# EAGLE design ai_breakout_tinyspi (EAGLE 6.5.0)
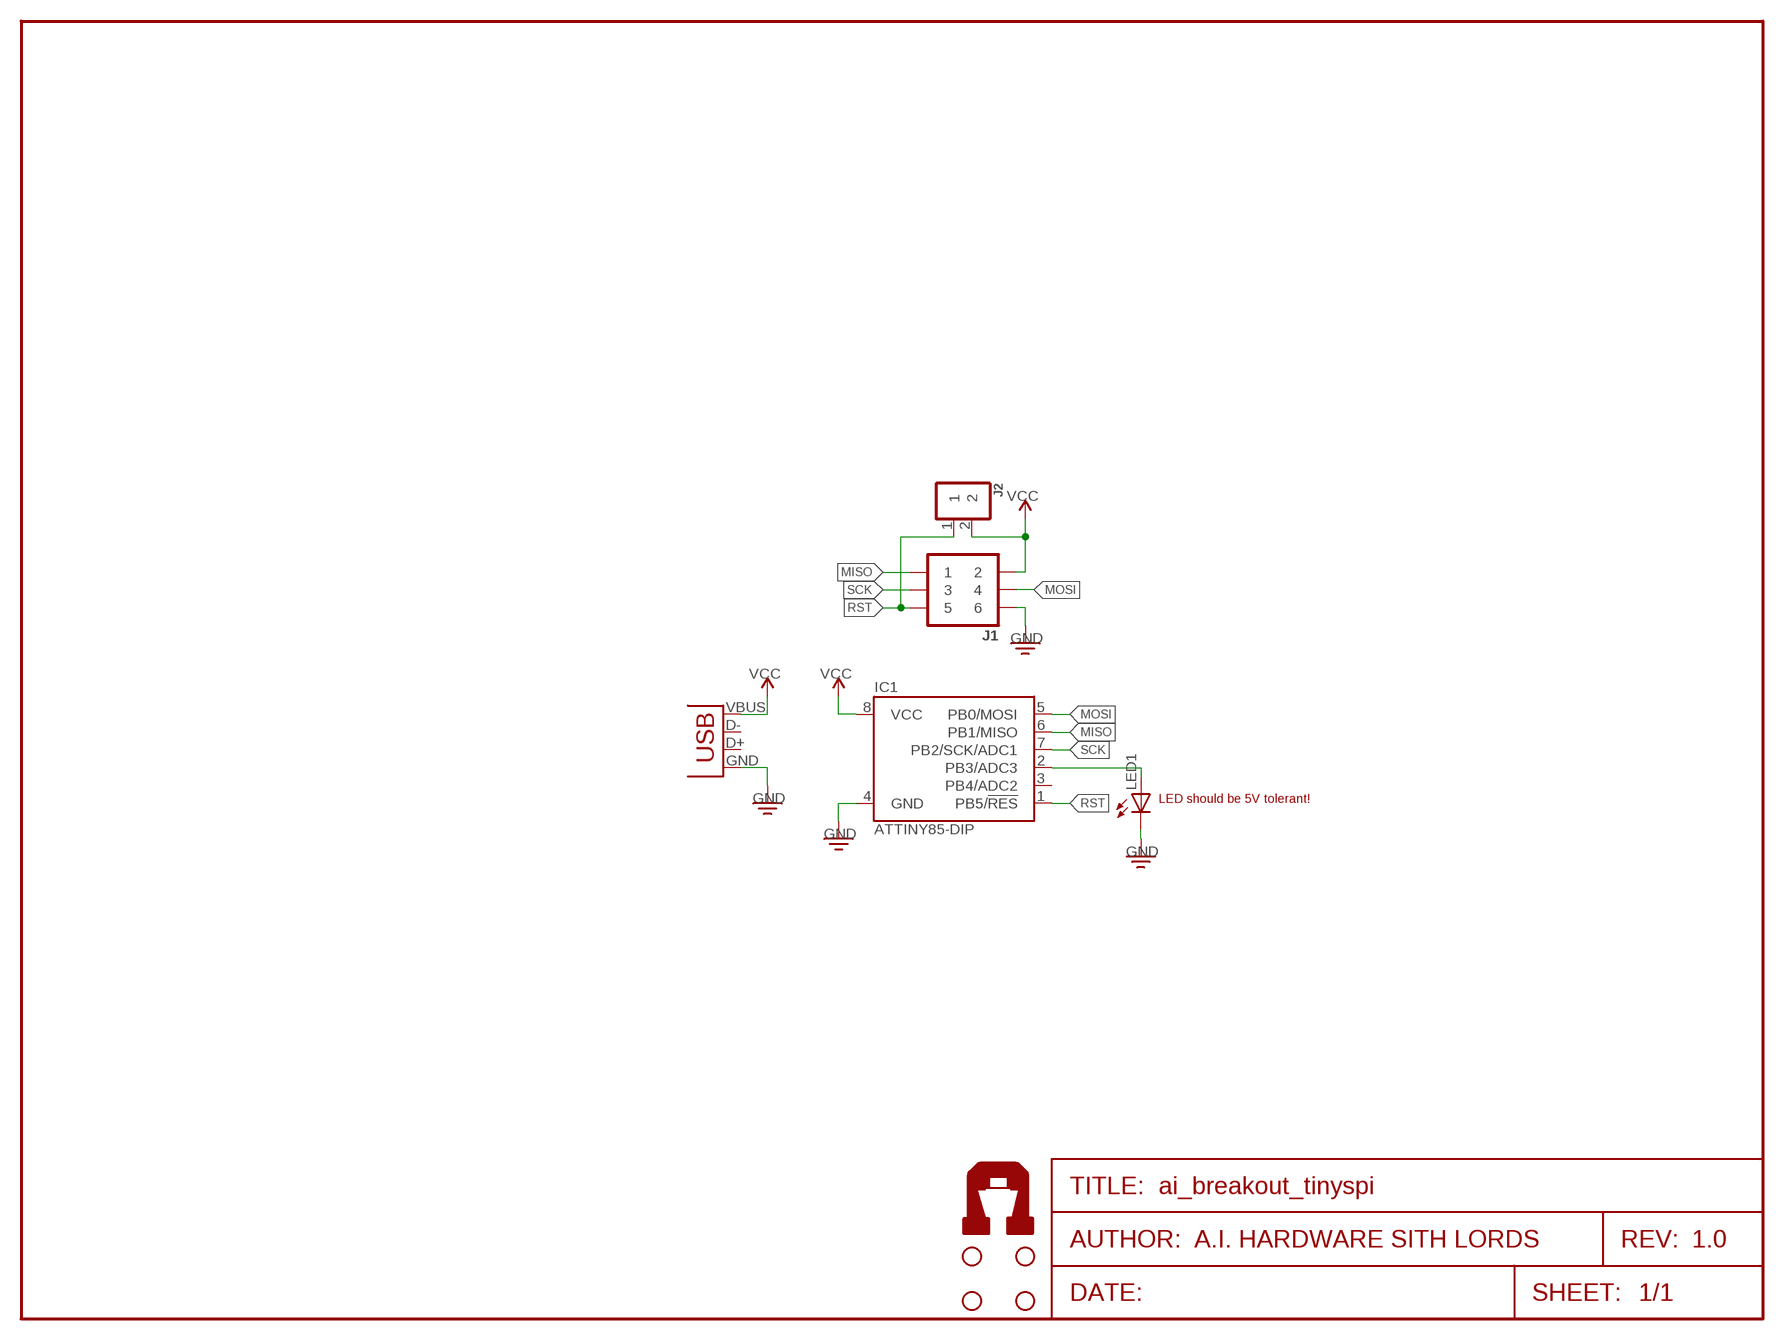
[diagram p0: schematic, sheet 1]
FRAME1 (FRAME-LETTER): AUTHOR: A.I. HARDWARE SITH LORDS; REV: 1.0

## Parts
IC1  ATTINY85-DIP  [DIL08]
J1  2X03  [2X03]
J2  1X02NOFIRST  [1X02-NOFIRST]
LED1  LED5MM  [LED-5MM]
STANDOFF1  STAND-OFF  [STAND-OFF]
STANDOFF2  STAND-OFF  [STAND-OFF]
STANDOFF3  STAND-OFF  [STAND-OFF]
STANDOFF4  STAND-OFF  [STAND-OFF]
U$1  AI-LOGOXS  [AI-LOGO-XS]
USB1  USBMICROB-TH  [USB-MICROB-TH]

## Nets
GND: IC1.4(GND) J1.6 LED1.C USB1.GND
MISO: IC1.6(PB1/MISO) J1.1
MOSI: IC1.5(PB0/MOSI) J1.4
N$1: IC1.2(PB3/ADC3) LED1.A
RST: IC1.1(PB5/!RES) J1.5 J2.1
SCK: IC1.7(PB2/SCK/ADC1) J1.3
VCC: IC1.8(VCC) J1.2 J2.2 USB1.VBUS
Unconnected: IC1.3(PB4/ADC2) USB1.D+ USB1.D-

## Notes on the sheet
- LED should be 5V tolerant!

## Library data of the parts
IC1 = Ai_IC:ATTINY: Atmel's 8-pin 2/4/8kB flash family of microcontrollers
J1 = Ai_Connectors:2X03
J2 = Ai_Connectors:1X02
LED1 = Ai_LED:LED
STANDOFF1-STANDOFF4 = Ai_Electromechanical:STAND-OFF: #4 Stand Off This is the mechanical footprint for a #4 phillips button head screw. Use the keepout ring to avoid running the screw head into surrounding components.
U$1 = Ai_Miscellany:AI-LOGO
USB1 = Ai_Connectors:USB

## Board
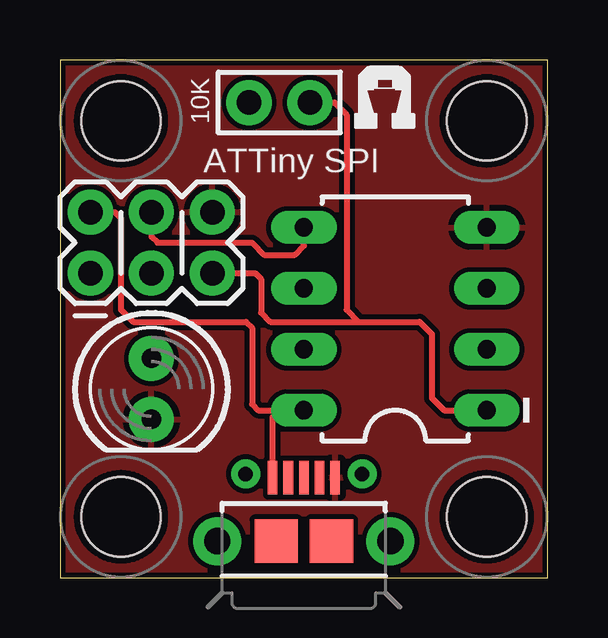
[diagram p1: board, top side]
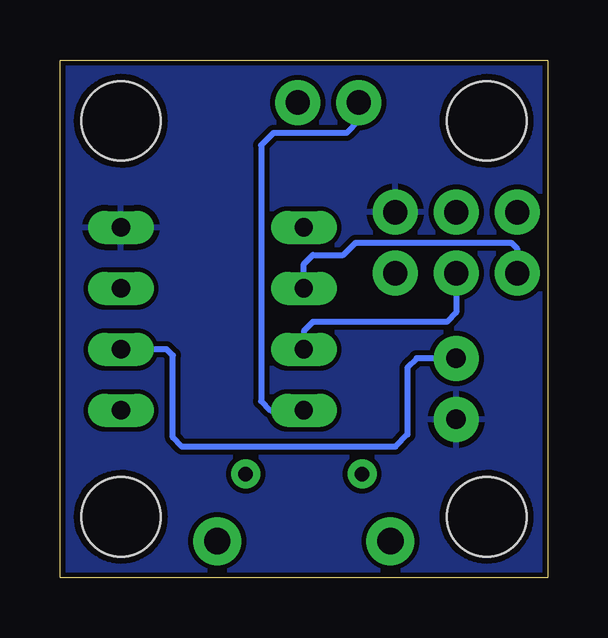
[diagram p2: board, bottom side, seen from below]

Size 20.32 x 21.59 mm. Coordinates in mm from the lower left corner, seen from the top.
Outline: 0,21.59 0,0 20.32,0 20.32,21.59 0,21.59
Copper layers (1*16): Top 0.035mm / dielectric 1.5mm / Bottom 0.035mm
Design rules "ai_2layer": minimum track width 7mil, minimum drill 15mil, track to track 8mil, track to pad 8mil, pad to pad 8mil, via to via 8mil, smd to smd 8mil, copper to edge 8mil, drill to drill 8mil, minimum pad ring 12mil, minimum via ring 10mil, stop-mask expansion 4mil, vias tented up to drill 20mil, thermal gap 10mil

### Footprints (pad centres in the part's own frame; a part is rotated, then mirrored left to right if it is on the bottom)
DIL08 = drill 0.762 pad 1.27 long: 1 -3.81,-3.81; 2 -1.27,-3.81; 3 1.27,-3.81; 4 3.81,-3.81; 5 3.81,3.81; 6 1.27,3.81; 7 -1.27,3.81; 8 -3.81,3.81
2X03 = drill 1.016 pad 1.88: 1 -2.54,-1.27; 2 -2.54,1.27; 3 0,-1.27; 4 0,1.27; 5 2.54,-1.27; 6 2.54,1.27
1X02-NOFIRST = drill 1.016 pad 1.88: 1 -1.27,0; 2 1.27,0
LED-5MM = drill 0.813 pad 1.88: A -1.27,0; C 1.27,0
STAND-OFF = hole 3.302: 0,0
USB-MICROB-TH = smd 0.4 x 1.4: D+ 0,2.65; D- -0.65,2.65; GND 1.3,2.65; ID 0.65,2.65; VBUS -1.3,2.65 | smd 1.8 x 1.8: M5 -1.15,0; M6 1.15,0 | drill 0.6 pad 1.2: MT1 -2.425,2.8; MT2 2.425,2.8 | drill 1.1 pad 2: MT3 -3.61,0; MT4 3.61,0

### Placement (x,y rotation side)
IC1  13.97,10.79 90 top
J1  3.81,13.97 0 top
J2  9.14,19.81 180 top
LED1  3.81,7.87 270 top
STANDOFF1  2.54,2.54 0 top
STANDOFF2  17.78,2.54 0 top
STANDOFF3  2.54,19.05 0 top
STANDOFF4  17.78,19.05 0 top
U$1  12.19,18.67 0 top
USB1  10.16,1.52 0 top

### Tracks (layer width: path | path; a pad name or v marks a point on that pad's centre or on a via)
GND
  pour Bottom: 0,21.59 0,0 20.32,0 20.32,21.59
  pour Top: 0,21.59 0,0 20.32,0 20.32,21.59
MISO
  Bottom 0.254: IC1.6 10.16,13.08 9.78,13.46 8.51,13.46 8,13.97 1.52,13.97 1.27,13.72 J1.1
MOSI
  Top 0.254: J1.4 3.81,14.22 4.06,13.97 8,13.97 8.51,13.46 9.78,13.46 10.16,13.84 IC1.5
N$1
  Bottom 0.254: LED1.A 5.46,9.14 5.84,8.76 5.84,5.97 6.35,5.46 15.24,5.46 15.62,5.84 15.62,9.27 15.88,9.53 IC1.2
RST
  Top 0.254: J1.5 8.13,12.7 8.38,12.45 8.38,11.05 8.76,10.67 12.45,10.67 | 12.45,10.67 14.99,10.67 15.49,10.16 15.49,7.49 16,6.99 IC1.1 | J2.1 11.43,19.81 11.94,19.3 11.94,11.18 12.45,10.67
SCK
  Bottom 0.254: J1.3 3.81,11.05 4.19,10.67 9.78,10.67 10.16,10.29 IC1.7
VCC
  Top 0.254: USB1.VBUS 8.86,6.7 9.14,6.99 | 9.14,6.99 IC1.8 | J1.2 2.29,15.24 2.54,14.99 2.54,11.18 3.05,10.67 7.75,10.67 8,10.41 8,7.24 8.26,6.99 9.14,6.99
  Bottom 0.254: J2.2 7.87,19.05 8.38,18.54 11.43,18.54 11.94,18.03 11.94,7.37 11.56,6.99 IC1.8

### Text on the board
tNames: 10K | ATTiny SPI